# EasyEDA Pro project ProDocument_DCATX-ATX24Pin_2023-09-14.epro

# Schematic Schematic-DCATX-ATX24p
Create Date: 2023-08-31; Page Name: P1; Project Name: CSPS_DCATX; Schematic Name: Schematic-DCATX-ATX24p; Update Date: 2023-08-31; Page Size: A3; Version: V1.0
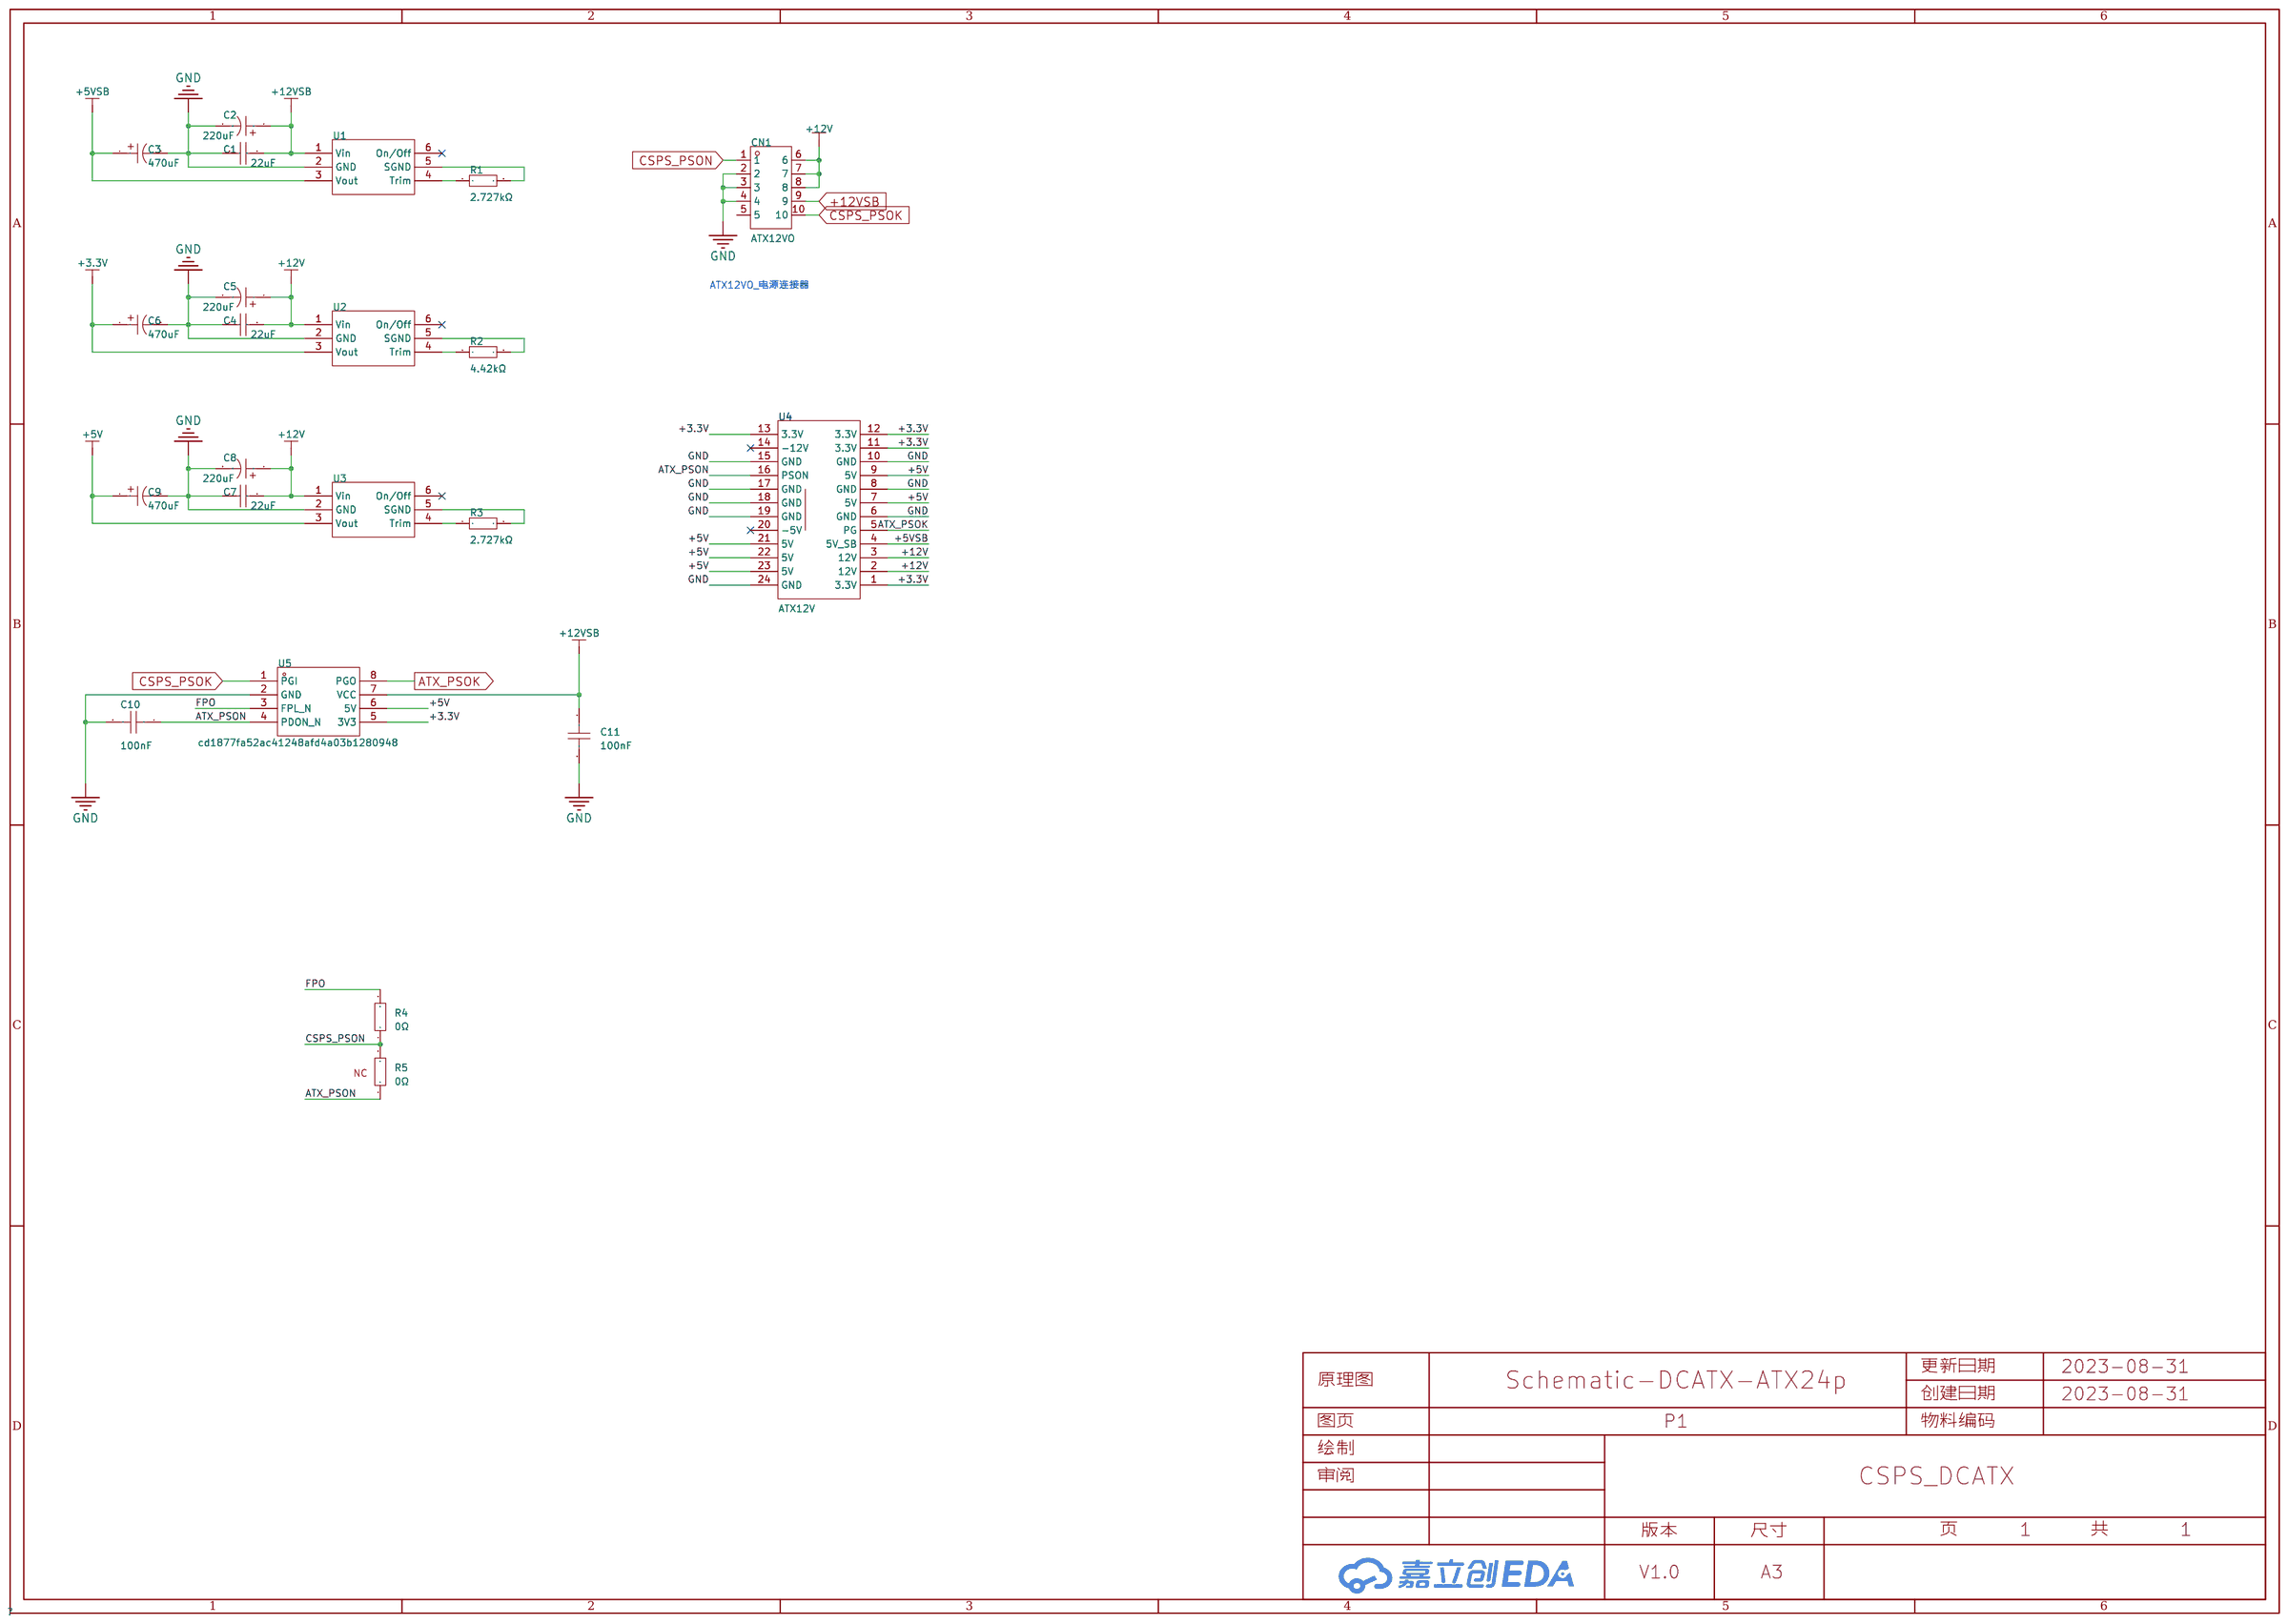
[diagram p0: schematic sheet]

## Parts
C1  22uF  [C1206]
C2  220uF  [CAP-SMD_BD6.3-L6.6-W6.6-FD]
C3  470uF  [CAP-SMD_BD8.0-L8.3-W8.3-LS9.0-FD]
C4  22uF  [C1206]
C5  220uF  [CAP-SMD_BD6.3-L6.6-W6.6-FD]
C6  470uF  [CAP-SMD_BD8.0-L8.3-W8.3-LS9.0-FD]
C7  22uF  [C1206]
C8  220uF  [CAP-SMD_BD6.3-L6.6-W6.6-FD]
C9  470uF  [CAP-SMD_BD8.0-L8.3-W8.3-LS9.0-FD]
C10  100nF  [C0603]
C11  100nF  [C0603]
CN1  ATX12VO  [CONN-TH_XKB_X9357WR-2X05S-N2SN]
R1  2.727kΩ  [R0603]
R2  4.42kΩ  [R0603]
R3  2.727kΩ  [R0603]
R4  0Ω  [R0603]
R5  0Ω  [R0603]
U1  -  [NAK12S20-C]
U2  -  [NAK12S20-C]
U3  -  [NAK12S20-C]
U4  ATX12V  [24pin夹板式]
U5  cd1877fa52ac41248afd4a03b1280948  [SOP-8_L4.9-W3.9-P1.27-LS6.0-BL]

## Library data of the parts
C1 C4 C7 = CL31A226KAHNNNE: 容值:22uF;精度:±10%;额定电压:25V;材质(温度系数):X5R;; LCSC Part Name: 22uF ±10% 25V; Supplier Part: C12891; Manufacturer: SAMSUNG(三星); Supplier Footprint: 1206; JLCPCB Part Class: 基础库; Datasheet: https://atta.szlcsc.com/upload/public/pdf/source/20160103/1457707667836.pdf; Supplier: LCSC; Tolerance: ±10%; Voltage Rated: 25V; Temperature Coefficient: X5R
C2 C5 C8 = RVT220UF16V67RV0015: 容值:220uF;精度:±20%;额定电压:16V;纹波电流:110mA@120Hz;等效串联电阻:-;; LCSC Part Name: 220uF ±20% 16V; Supplier Part: C2887273; Manufacturer: KNSCHA(科尼盛); Supplier Footprint: SMD,D6.3xL7.7mm; JLCPCB Part Class: 扩展库; Datasheet: https://atta.szlcsc.com/upload/public/pdf/source/20210824/3DC9999D9B098FE241E3A26137981C4C.pdf; Supplier: LCSC; Tolerance: ±20%; Rated Voltage: 16V; φD: 6.3mm; L: 7.7mm; Ripple Current: 110mA@120Hz; Lifetime @ Temp: 2000hrs@105℃; Operating Temperature: -55℃~+105℃
C3 C6 C9 = RVT470UF16V67RV0031: 容值:470uF;额定电压:16V;工作寿命:2000hrs@105℃;; LCSC Part Name: 470uF 16V; Supplier Part: C2858857; Manufacturer: KNSCHA(科尼盛); Supplier Footprint: SMD,8x10.2mm; JLCPCB Part Class: 扩展库; Supplier: LCSC; Rated Voltage: 16V; Lifetime @ Temp: 2000hrs@105℃
C10 C11 = CAP_0603: Supplier Footprint: 0603
CN1 = X9357WR-2x05S-N2SN: 参考系列:-;间距:4.2mm;插针结构:2x5P;排数:2;每排PIN数:5;行距:4.2mm;公母:母型插口;安装方式:弯插;额定电流:9A;触头材质:黄铜;触头镀层:锡;工作温度范围:-25℃~+85℃;焊接温度(最大值):260℃;; LCSC Part Name: 4.2mm 2x5P 弯插; Supplier Part: C2879918; Manufacturer: XKB Connectivity(中国星坤); Supplier Footprint: 弯插,P=4.2mm; JLCPCB Part Class: 扩展库; Datasheet: https://atta.szlcsc.com/upload/public/pdf/source/20210413/C2764607_16D34CB1CA305839314A63AD5DCB5686.pdf; Supplier: LCSC; Pitch: 4.2mm; Pins Structure: 2x5P; Number of Rows: 2; Number of PINs Per Row: 5; Row Spacing: 4.2mm; Gender: 母型插口; Mounting Style: 弯插; Current Rating (Max): 9A; Contact Material: 黄铜; Contact Plating: 锡; Operating Temperature Range: -25℃~+85℃; Welding Temperature (Max): 260℃
R1-R3 = 0603WAF4421T5E: 电阻类型:厚膜电阻;阻值:4.42kΩ;精度:±1%;功率:100mW;; LCSC Part Name: 4.42kΩ ±1% 100mW; Supplier Part: C23043; Manufacturer: UNI-ROYAL(厚声); Supplier Footprint: 0603; JLCPCB Part Class: 扩展库; Datasheet: https://atta.szlcsc.com/upload/public/pdf/source/20200306/C422600_1E6D84923E4A46A82E41ADD87F860B5C.pdf; Supplier: LCSC; Type: 厚膜电阻; Tolerance: ±1%; Power(Watts): 100mW; Temperature Coefficient: ±100ppm/℃; Overload Voltage (Max): 75V; Operating Temperature Range: -55℃~+155℃
R4 R5 = 0603WAF0000T5E: 电阻类型:厚膜电阻;阻值:0Ω;精度:±1%;功率:100mW;; LCSC Part Name: 0Ω ±1% 100mW; Supplier Part: C21189; Manufacturer: UNI-ROYAL(厚声); Supplier Footprint: 0603; JLCPCB Part Class: 基础库; Datasheet: https://atta.szlcsc.com/upload/public/pdf/source/20200306/C422600_1E6D84923E4A46A82E41ADD87F860B5C.pdf; Supplier: LCSC; Type: 厚膜电阻; Tolerance: ±1%; Power(Watts): 100mW; Overload Voltage (Max): 75V; Operating Temperature Range: -55℃~+155℃
U1-U3 = NAK12S20-C: 华为降压模块; Manufacturer: HUAWEI; Frequency: 300kHz
U4 = atx24pin夹板式
U5 = WT7510

## Nets
+3.3V: C6.1 U2.3(Vout) U4.1(3.3V) U4.11(3.3V) U4.12(3.3V) U4.13(3.3V) U5.5(3V3)
+5V: C9.1 U3.3(Vout) U4.7(5V) U4.9(5V) U4.21(5V) U4.22(5V) U4.23(5V) U5.6(5V)
+5VSB: C3.1 U1.3(Vout) U4.4(5V_SB)
+12V: C4.2 C5.1 C7.2 C8.1 CN1.6 CN1.7 CN1.8 U2.1(Vin) U3.1(Vin) U4.2(12V) U4.3(12V)
+12VSB: C1.2 C2.1 C11.1 CN1.9 U1.1(Vin) U5.7(VCC)
GND: C1.1 C2.2 C3.2 C4.1 C5.2 C6.2 C7.1 C8.2 C9.2 C10.2 C11.2 CN1.2 CN1.3 CN1.4 U1.2(GND) U2.2(GND) U3.2(GND) U4.6(GND) U4.8(GND) U4.10(GND) U4.15(GND) U4.17(GND) U4.18(GND) U4.19(GND) U4.24(GND) U5.2(GND)
ATX_PSOK: U4.5(PG) U5.8(PGO)
ATX_PSON: C10.1 R5.1 U4.16(PSON) U5.4(PDON_N)
CSPS_PSOK: CN1.10 U5.1(PGI)
CSPS_PSON: CN1.1 R4.1 R5.2
FPO: R4.2 U5.3(FPL_N)
$1N251: R1.1 U1.4(Trim)
$1N252: R1.2 U1.5(SGND)
$1N482: R2.1 U2.4(Trim)
$1N483: R2.2 U2.5(SGND)
$1N713: R3.1 U3.4(Trim)
$1N714: R3.2 U3.5(SGND)

Not connected (* = marked no-connect by the designer): CN1 5; U1 6(On/Off)*; U2 6(On/Off)*; U3 6(On/Off)*; U4 14(-12V)* 20(-5V)*

## Notes on the sheet
- ATX12VO_电源连接器
- NC

# Board PCB-DCATX-ATX24p
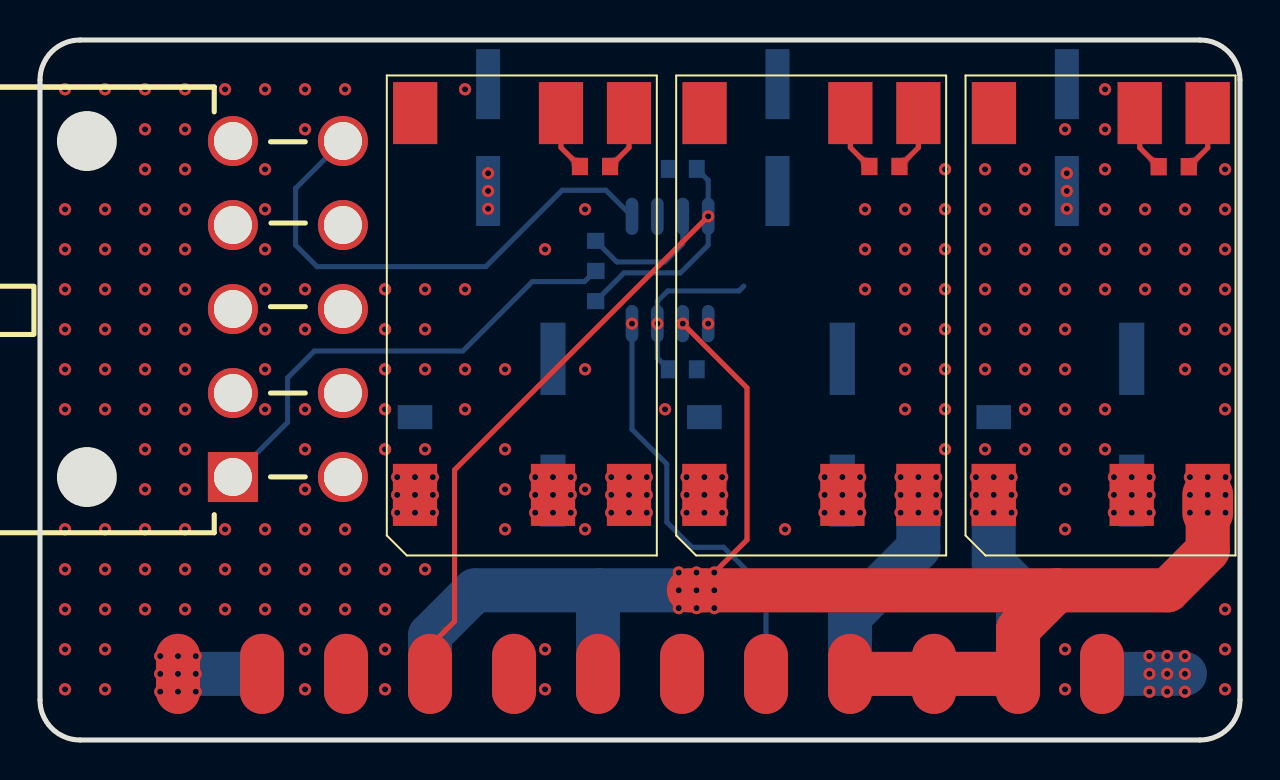
[diagram p1: board, top side]
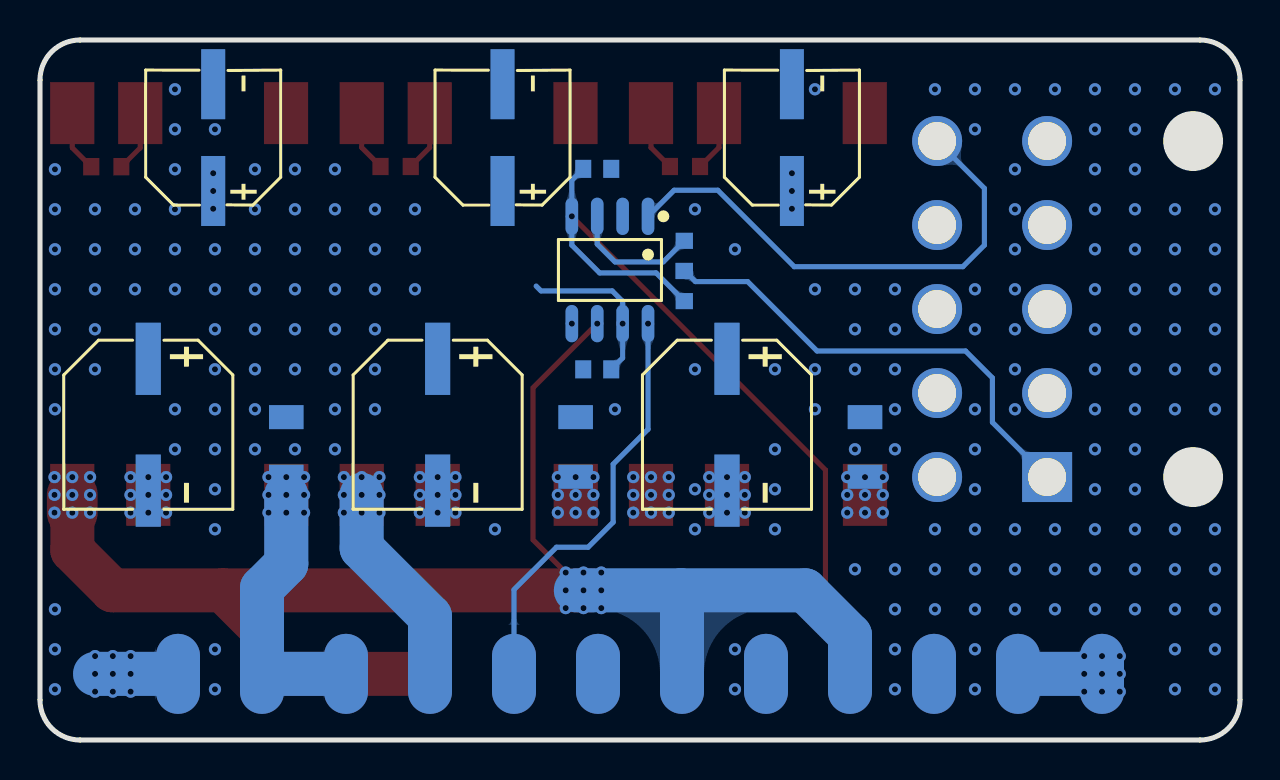
[diagram p2: board, bottom side, seen from below]

Outline 60 x 35 mm; copper layers: Top Layer, +12V, +3.3V, Bottom Layer. Coordinates in mm from the lower left corner of the outline.
Outline path: 0,33 0,2 arc(0.59,0.59) 2,0 58,0 arc(59.41,0.59) 60,2 60,33 arc(59.41,34.41) 58,35 2,35 arc(0.59,34.41) 0,33
Stack: Top Layer 0.035mm 外层铜厚1oz / Dielectric1 0.2104mm 7628 RC49% 8.6mil / +12V 0.0152mm 内层铜厚 / Dielectric2 1.065mm 1.1mm H/HOZ 含铜 / +3.3V 0.0152mm 内层铜厚 / Dielectric3 0.2104mm 7628 RC49% 8.6mil / Bottom Layer 0.035mm 外层铜厚1oz

## Design rules (mm)
template: 自定义配置
spacing copperThickness1oz (default): track to track 0.102, other pairs 0.152 to 0.3
spacing copperThickness2oz: track to track 0.203, other pairs 0.152 to 0.3
track width copperThickness1oz (default): min 0.127, default 0.254, max 2.54
track width copperThickness2oz: min 0.203, default 0.254, max 2.54
differential pair differentialPair (default): width min 0.127, default 0.254, max 2.54; gap min 0.152, default 0.152
via viaSize (default): diameter min 0.5, default 0.61, max 10; hole min 0.3, default 0.305, max 6.3

## Placement (name value [footprint] x y rotation side)
C1  22uF  [C1206]  33.22 14.65 270 bottom
C2  220uF  [CAP-SMD_BD6.3-L6.6-W6.6-FD]  36.87 30.12 90 bottom
C3  470uF  [CAP-SMD_BD8.0-L8.3-W8.3-LS9.0-FD]  40.12 15.76 270 bottom
C4  22uF  [C1206]  18.75 14.65 270 bottom
C5  220uF  [CAP-SMD_BD6.3-L6.6-W6.6-FD]  22.41 30.12 90 bottom
C6  470uF  [CAP-SMD_BD8.0-L8.3-W8.3-LS9.0-FD]  25.65 15.76 270 bottom
C7  22uF  [C1206]  47.69 14.65 270 bottom
C8  220uF  [CAP-SMD_BD6.3-L6.6-W6.6-FD]  51.34 30.12 90 bottom
C9  470uF  [CAP-SMD_BD8.0-L8.3-W8.3-LS9.0-FD]  54.59 15.76 270 bottom
C10  100nF  [C0603]  32.14 28.56 180 bottom
C11  100nF  [C0603]  32.14 18.53 0 bottom
CN1  ATX12VO  [CONN-TH_XKB_X9357WR-2X05S-N2SN]  12.39 21.55 270 top
R1  2.727kΩ  [R0603]  42.22 28.68 180 top
R2  4.42kΩ  [R0603]  27.75 28.68 180 top
R3  2.727kΩ  [R0603]  56.69 28.67 180 top
R4  0Ω  [R0603]  27.78 24.2 90 bottom
R5  0Ω  [R0603]  27.78 22.7 90 bottom
U1  -  [NAK12S20-C]  38.56 21.23 90 top
U2  -  [NAK12S20-C]  24.09 21.23 90 top
U3  -  [NAK12S20-C]  53.03 21.23 90 top
U4  ATX12V  [24pin夹板式]  30 3.31 0 top
U5  cd1877fa52ac41248afd4a03b1280948  [SOP-8_L4.9-W3.9-P1.27-LS6.0-BL]  31.5 23.5 0 bottom

## Footprints (pads in the part's own frame, mm; a bottom-side part is the same pattern mirrored in y, then rotated)
24pin夹板式
  oval 2.2x4 smd far side: 1(23.1,0) 2(18.9,0) 3(14.7,0) 4(10.5,0) 5(6.3,0) 6(2.1,0) 7(-2.1,0) 8(-6.3,0) 9(-10.5,0) 10(-14.7,0) 11(-18.9,0) 12(-23.1,0)
  oval 2.2x4 smd: 13(-23.1,0) 14(-18.9,0) 15(-14.7,0) 16(-10.5,0) 17(-6.3,0) 18(-2.1,0) 19(2.1,0) 20(6.3,0) 21(10.5,0) 22(14.7,0) 23(18.9,0) 24(23.1,0)
C0603
  rect 0.8x0.9 smd: 1(-0.7,0) 2(0.7,0)
C1206
  rect 1.2x1.728 smd: 1(-1.491,0) 2(1.491,0)
CAP-SMD_BD6.3-L6.6-W6.6-FD
  rect 3.5x1.2 smd: 1(-2.67,0) 2(2.67,0)
CAP-SMD_BD8.0-L8.3-W8.3-LS9.0-FD
  rect 3.61x1.26 smd: 1(-3.295,0) 2(3.295,0)
CONN-TH_XKB_X9357WR-2X05S-N2SN
  rect 2.5x2.5 hole 1.9x1.7: 1(8.4,-2.75)
  round 2.5 hole 1.9x1.7: 2(4.2,-2.75) 3(0,-2.75) 4(-4.2,-2.75) 5(-8.4,-2.75) 6(8.4,2.75) 7(4.2,2.75) 8(0,2.75) 9(-4.2,2.75) 10(-8.4,2.75)
NAK12S20-C
  custom 3.1x2.21 smd: 1(-8.97,5.34) 2(-8.97,-1.56) 3(-8.97,-5.36) 4(10.12,-5.36) 5(10.12,-1.96) 6(10.12,5.33)
R0603
  rect 0.806x0.864 smd: 1(-0.753,0) 2(0.753,0)
SOP-8_L4.9-W3.9-P1.27-LS6.0-BL
  oval 0.63x1.865 smd: 1(-1.905,-2.683) 2(-0.635,-2.683) 3(0.635,-2.683) 4(1.905,-2.683) 5(1.905,2.683) 6(0.635,2.683) 7(-0.635,2.683) 8(-1.905,2.683)

## Nets
As in the schematic.

Pads without a net: CN1 5; U1 6; U2 6; U3 6; U4 14 20

## Via types
v1: diameter 0.61, hole 0.305, Top Layer to Bottom Layer, 119 vias
v2: diameter 0.61, hole 0.304, Top Layer to Bottom Layer, 183 vias

## Routing (per net, layer and track width the routed paths; a pad name or vN(x,y) marks a point on that pad's centre or on a via; arc(x,y) is an arc through that point)
+3.3V: length 8.3
  Bottom Layer w2.2: v1(6.9,3.31) v1(7.79,3.31) U4.11 ; v1(57.25,3.31) v1(56.36,3.31) v1(55.47,3.31) U4.1
  vias: v1(6.01,4.2) v1(6.01,3.31) v1(6.01,2.42) v1(6.9,4.2) v1(6.9,2.42) v1(7.79,4.2) v1(7.79,2.42) v1(28.56,13.14) v1(28.56,12.26) v1(28.56,11.37) v1(29.45,13.14) v1(29.45,12.26) v1(29.45,11.37) v1(30.34,13.14) v1(30.34,12.26) v1(30.34,11.37) v1(33.41,20.82) v1(55.47,4.2) v1(55.47,2.42) v1(56.36,4.2) v1(56.36,2.42) v1(57.25,4.2) v1(57.25,2.42)
+5V: length 77.4
  Top Layer w0.254: v1(33.71,8.37) 35.35,10.01 35.35,17.61 v1(32.14,20.82)
  Top Layer w2.2: U4.21 U4.22 U4.23 48.9,5.54 50.84,7.48 ; 50.84,7.48 v1(33.71,7.48) ; 50.84,7.48 56.38,7.48 58.39,9.49 v1(58.39,11.37) ; 33.33,7.48 v1(32.83,7.48) 32.44,7.48
  Top Layer w2.54: v1(58.39,11.37) v1(58.39,12.26)
  Bottom Layer w2.2: 27.95,7.48 27.9,7.44 U4.7 ; 27.95,7.48 v1(31.94,7.48) ; 27.95,7.48 21.74,7.48 19.5,5.24 U4.9 ; 32.32,7.48 v1(32.83,7.48) 33.21,7.48
  vias: v1(31.94,8.37) v1(31.94,6.59) v1(32.83,8.37) v1(32.83,6.59) v1(33.71,6.59) v1(57.5,13.14) v1(57.5,12.26) v1(57.5,11.37) v1(58.39,13.14) v1(59.28,13.14) v1(59.28,12.26) v1(59.28,11.37)
+5VSB: length 10.4
  Bottom Layer w2.2: v1(43.92,12.26) v1(43.92,11.37) 43.92,9.6 40.5,6.18 U4.4
  vias: v1(43.03,13.14) v1(43.03,12.26) v1(43.03,11.37) v1(43.92,13.14) v1(44.81,13.14) v1(44.81,12.26) v1(44.81,11.37)
+12V: length 13.7
  Bottom Layer w2.2: v1(47.69,12.26) v1(47.69,11.37) 47.69,8.81 48.9,7.59 U4.2 U4.3
  vias: v1(17.86,13.14) v1(17.86,12.26) v1(17.86,11.37) v1(18.75,13.14) v1(18.75,12.26) v1(18.75,11.37) v1(19.64,13.14) v1(19.64,12.26) v1(19.64,11.37) v1(22.41,28.34) v1(22.41,27.45) v1(22.41,26.56) v1(46.8,13.14) v1(46.8,12.26) v1(46.8,11.37) v1(47.69,13.14) v1(48.57,13.14) v1(48.57,12.26) v1(48.57,11.37) v1(51.34,28.34) v1(51.34,27.45) v1(51.34,26.56)
+12VSB: length 8.3
  Bottom Layer w0.254: C11.1 30.87,19.1 v1(30.87,20.82) 30.87,21.93 31.39,22.45 34.95,22.45 35.19,22.7
  vias: v1(32.33,13.14) v1(32.33,12.26) v1(32.33,11.37) v1(33.22,13.14) v1(33.22,12.26) v1(33.22,11.37) v1(34.11,13.14) v1(34.11,12.26) v1(34.11,11.37)
GND:
  vias: v1(24.76,13.14) v1(24.76,12.26) v1(24.76,11.37) v1(25.65,13.14) v1(25.65,12.26) v1(25.65,11.37) v1(26.54,13.14) v1(26.54,12.26) v1(26.54,11.37) v1(39.23,13.14) v1(39.23,12.26) v1(39.23,11.37) v1(40.12,13.14) v1(40.12,12.26) v1(40.12,11.37) v1(41.01,13.14) v1(41.01,12.26) v1(41.01,11.37) v1(53.7,13.14) v1(53.7,12.26) v1(53.7,11.37) v1(54.59,13.14) v1(54.59,12.26) v1(54.59,11.37) v1(55.47,13.14) v1(55.47,12.26) v1(55.47,11.37) v2(1.25,32.54) v2(1.25,26.54) v2(1.25,24.54) v2(1.25,22.54) v2(1.25,20.54) v2(1.25,18.54) v2(1.25,16.54) v2(1.25,10.54) v2(1.25,8.54) v2(1.25,6.54) v2(1.25,4.54) v2(1.25,2.54) v2(3.25,32.54) v2(3.25,26.54) v2(3.25,24.54) v2(3.25,22.54) v2(3.25,20.54) v2(3.25,18.54) v2(3.25,16.54) v2(3.25,10.54) v2(3.25,8.54) v2(3.25,6.54) v2(3.25,4.54) v2(3.25,2.54) v2(5.25,32.54) v2(5.25,30.54) v2(5.25,28.54) v2(5.25,26.54) v2(5.25,24.54) v2(5.25,22.54) v2(5.25,20.54) v2(5.25,18.54) v2(5.25,16.54) v2(5.25,14.54) v2(5.25,12.54) v2(5.25,10.54) v2(5.25,8.54) v2(5.25,6.54) v2(7.25,32.54) v2(7.25,30.54) v2(7.25,28.54) v2(7.25,26.54) v2(7.25,24.54) v2(7.25,22.54) v2(7.25,20.54) v2(7.25,18.54) v2(7.25,16.54) v2(7.25,14.54) v2(7.25,12.54) v2(7.25,10.54) v2(7.25,8.54) v2(7.25,6.54) v2(9.25,32.54) v2(9.25,10.54) v2(9.25,8.54) v2(9.25,6.54) v2(11.25,32.54) v2(11.25,28.54) v2(11.25,26.54) v2(11.25,24.54) v2(11.25,22.54) v2(11.25,20.54) v2(11.25,18.54) v2(11.25,16.54) v2(11.25,10.54) v2(11.25,8.54) v2(11.25,6.54) v2(13.25,32.54) v2(13.25,30.54) v2(13.25,22.54) v2(13.25,20.54) v2(13.25,16.54) v2(13.25,14.54) v2(13.25,12.54) v2(13.25,10.54) v2(13.25,8.54) v2(13.25,6.54) v2(13.25,4.54) v2(13.25,2.54) v2(15.25,32.54) v2(15.25,10.54) v2(15.25,8.54) v2(15.25,6.54) v2(17.25,22.54) v2(17.25,20.54) v2(17.25,18.54) v2(17.25,16.54) v2(17.25,14.54) v2(17.25,8.54) v2(17.25,6.54) v2(17.25,4.54) v2(17.25,2.54) v2(19.25,22.54) v2(19.25,20.54) v2(19.25,18.54) v2(19.25,14.54) v2(19.25,8.54) v2(21.25,32.54) v2(21.25,22.54) v2(21.25,18.54) v2(21.25,16.54) v2(23.25,18.54) v2(23.25,14.54) v2(23.25,12.54) v2(23.25,10.54) v2(25.25,24.54) v2(25.25,4.54) v2(25.25,2.54) v2(27.25,26.54) v2(27.25,18.54) v2(27.25,12.54) v2(27.25,10.54) v2(31.25,16.54) v2(37.25,10.54) v2(41.25,26.54) v2(41.25,24.54) v2(41.25,22.54) v2(43.25,26.54) v2(43.25,24.54) v2(43.25,22.54) v2(43.25,20.54) v2(43.25,18.54) v2(43.25,16.54) v2(45.25,28.54) v2(45.25,26.54) v2(45.25,24.54) v2(45.25,22.54) v2(45.25,20.54) v2(45.25,18.54) v2(45.25,16.54) v2(45.25,14.54) v2(47.25,28.54) v2(47.25,26.54) v2(47.25,24.54) v2(47.25,22.54) v2(47.25,20.54) v2(47.25,18.54) v2(47.25,14.54) v2(49.25,28.54) v2(49.25,26.54) v2(49.25,24.54) v2(49.25,22.54) v2(49.25,20.54) v2(49.25,18.54) v2(49.25,16.54) v2(49.25,14.54) v2(51.25,30.54) v2(51.25,24.54) v2(51.25,22.54) v2(51.25,20.54) v2(51.25,18.54) v2(51.25,16.54) v2(51.25,14.54) v2(51.25,12.54) v2(51.25,10.54) v2(51.25,4.54) v2(51.25,2.54) v2(53.25,32.54) v2(53.25,30.54) v2(53.25,28.54) v2(53.25,26.54) v2(53.25,24.54) v2(53.25,22.54) v2(53.25,16.54) v2(53.25,14.54) v2(55.25,26.54) v2(55.25,24.54) v2(55.25,22.54) v2(57.25,26.54) v2(57.25,24.54) v2(57.25,22.54) v2(57.25,20.54) v2(57.25,18.54) v2(59.25,28.54) v2(59.25,26.54) v2(59.25,24.54) v2(59.25,22.54) v2(59.25,20.54) v2(59.25,18.54) v2(59.25,16.54) v2(59.25,6.54) v2(59.25,4.54) v2(59.25,2.54)
ATX_PSOK: length 21.2
  Bottom Layer w0.254: v1(29.6,20.82) 29.6,15.53 31.34,13.79 31.34,10.89 32.59,9.64 34.18,9.64 36.3,7.51 U4.5
ATX_PSON: length 39.5
  Top Layer w0.254: v1(33.41,26.18) 20.73,13.5 20.73,5.93 19.5,4.71 U4.16
  Bottom Layer w0.254: R5.1 29.2,23.36 32.02,23.36 33.41,24.74 v1(33.41,26.18) 33.41,27.99 C10.1
CSPS_PSOK: length 25.6
  Bottom Layer w0.254: U5.1 28.29,27.49 26.11,27.49 22.29,23.67 13.86,23.67 12.78,24.74 12.78,27.58 CN1.10
CSPS_PSON: length 23.7
  Bottom Layer w0.254: CN1.1 12.38,15.88 12.38,18.11 13.72,19.45 21.15,19.45 24.62,22.92 27.23,22.92 27.76,23.45 R4.1
FPO: length 6.5
  Bottom Layer w0.254: R4.2 28.84,23.9 31.25,23.9 32.14,24.79 U5.3
$1N251: length 3.1
  Top Layer w0.254: R1.1 43.92,29.62 U1.4
$1N252: length 3.1
  Top Layer w0.254: U1.5 40.52,29.62 R1.2
$1N482: length 3.1
  Top Layer w0.254: U2.4 29.45,29.62 R2.1
$1N483: length 3.1
  Top Layer w0.254: R2.2 26.05,29.62 U2.5
$1N713: length 3.1
  Top Layer w0.254: U3.4 58.39,29.61 R3.1
$1N714: length 3.1
  Top Layer w0.254: R3.2 54.99,29.61 U3.5

## Copper pours and planes (outline as drawn; the poured copper is in the pictures)
+3.3V on Bottom Layer: 30.94,10.81 27.99,10.81 27.99,13.71 24.97,16.74 24.97,20.91 26.33,20.91 26.33,17.98 30.94,13.37
+3.3V on +3.3V: 0.26,34.74 59.74,34.74 59.74,0.26 0.26,0.26
+5V on Bottom Layer: 59.87,10.81 56.93,10.81 56.93,13.71 53.91,16.74 53.91,20.91 55.27,20.91 55.27,17.98 59.87,13.37
+5VSB on Bottom Layer: 45.41,10.81 42.46,10.81 42.46,13.71 39.44,16.74 39.44,20.91 40.8,20.91 40.8,17.98 45.41,13.37
+12V on +12V: 0.26,34.74 59.74,34.74 59.74,0.26 0.26,0.26
+12VSB on Bottom Layer: 34.65,10.45 31.82,10.45 31.82,13.94 34.33,16.46 34.33,28.31 33.32,29.32 30.64,29.32 29.59,28.27 24.06,28.27 23.07,29.26 21.73,29.26 16.13,23.67 13.86,23.67 12.78,24.74 12.78,27.03 13.63,27.88 15.87,27.88 18.99,31 23.14,31 24.75,32.61 34.47,32.61 36.21,30.87 37.51,30.87 38.8,29.58 38.8,14.6
GND on Top Layer: -6.37,35.99 67.58,35.99 67.58,-0.53 -6.37,-0.53
GND on Bottom Layer: -0.75,35.99 60.65,35.99 60.65,-7.46 -0.75,-7.46

Small or netless copper shapes (teardrops, artwork), in the pictures only: 14 on Top Layer, 30 on Bottom Layer
